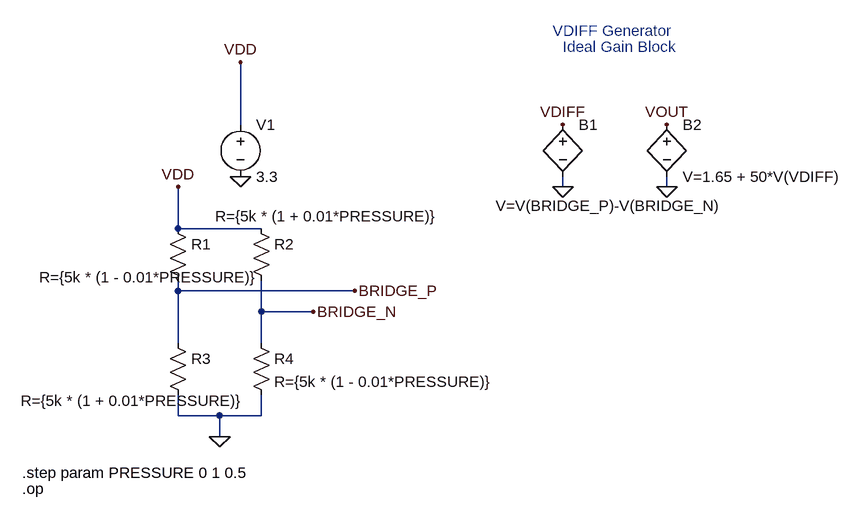
[diagram p0: schematic mems_pressure_bridge_readout.asc]
mems_pressure_bridge_readout.asc, the LTspice schematic file:
Version 4.1
SHEET 1 1224 800
WIRE -96 112 -96 16
WIRE 400 208 400 192
WIRE 560 208 560 192
WIRE -192 272 -192 208
WIRE -64 272 -192 272
WIRE -192 368 -192 352
WIRE 80 368 -192 368
WIRE -64 400 -64 352
WIRE 16 400 -64 400
WIRE -192 448 -192 368
WIRE -64 448 -64 400
WIRE -192 560 -192 528
WIRE -128 560 -192 560
WIRE -64 560 -64 528
WIRE -64 560 -128 560
WIRE -128 592 -128 560
FLAG -128 592 0
FLAG -96 192 0
FLAG -96 16 VDD
FLAG -192 208 VDD
FLAG 80 368 BRIDGE_P
FLAG 16 400 BRIDGE_N
FLAG 400 112 VDIFF
FLAG 400 208 0
FLAG 560 112 VOUT
FLAG 560 208 0
SYMBOL res -208 256 R0
WINDOW 3 -198 91 Left 2
SYMATTR Value R={5k * (1 - 0.01*PRESSURE)}
SYMATTR InstName R1
SYMBOL res -80 256 R0
WINDOW 3 -55 -3 Left 2
SYMATTR Value R={5k * (1 + 0.01*PRESSURE)}
SYMATTR InstName R2
SYMBOL res -208 432 R0
WINDOW 3 -226 105 Left 2
SYMATTR Value R={5k * (1 + 0.01*PRESSURE)}
SYMATTR InstName R3
SYMBOL res -80 432 R0
SYMATTR InstName R4
SYMATTR Value R={5k * (1 - 0.01*PRESSURE)}
SYMBOL voltage -96 96 R0
SYMATTR InstName V1
SYMATTR Value 3.3
SYMBOL bv 400 96 R0
WINDOW 3 -103 141 Left 2
SYMATTR Value V=V(BRIDGE_P)-V(BRIDGE_N)
SYMATTR InstName B1
SYMBOL bv 560 96 R0
SYMATTR InstName B2
SYMATTR Value V=1.65 + 50*V(VDIFF)
TEXT 384 -32 Left 2 ;VDIFF Generator
TEXT 400 -8 Left 2 ;Ideal Gain Block
TEXT -432 648 Left 2 !.step param PRESSURE 0 1 0.5
TEXT -432 672 Left 2 !.op

The netlist it stands for:
* mems_pressure_bridge_readout.asc
R1 VDD BRIDGE_P R={5k * (1 - 0.01*PRESSURE)}
R2 VDD BRIDGE_N R={5k * (1 + 0.01*PRESSURE)}
R3 BRIDGE_P 0 R={5k * (1 + 0.01*PRESSURE)}
R4 BRIDGE_N 0 R={5k * (1 - 0.01*PRESSURE)}
V1 VDD 0 3.3
B1 VDIFF 0 V=V(BRIDGE_P)-V(BRIDGE_N)
B2 VOUT 0 V=1.65 + 50*V(VDIFF)
* VDIFF Generator
* Ideal Gain Block
.step param PRESSURE 0 1 0.5
.op
.backanno
.end

* Results of the author's LTspice run, read from the files saved beside the schematic
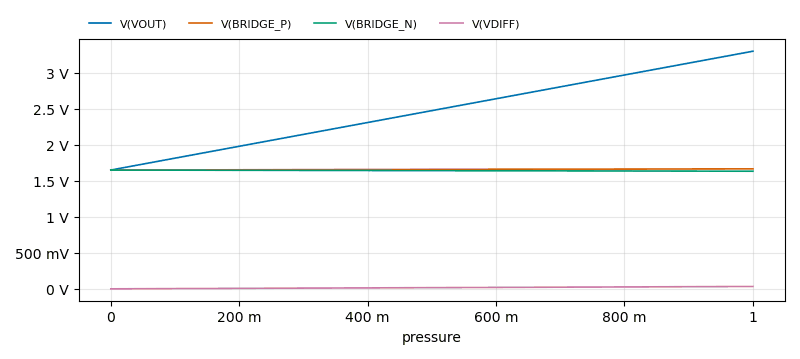
[diagram p1: Operating Point of mems_pressure_bridge_readout.asc, plotted from the saved traces]
* Operating Point, 1 run:
*   V(VOUT): 1.65 V at pressure=0, 3.3 V at pressure=1 , min 1.65 V, max 3.3 V
*   V(BRIDGE_P): 1.65 V at pressure=0, 1.666 V at pressure=1 , min 1.65 V, max 1.666 V
*   V(BRIDGE_N): 1.65 V at pressure=0, 1.633 V at pressure=1 , min 1.633 V, max 1.65 V
*   V(VDIFF): 0 V at pressure=0, 33 mV at pressure=1 , min 0 V, max 33 mV